# Altium schematic sheet Relay_Out_Interface.SchDoc
size A4
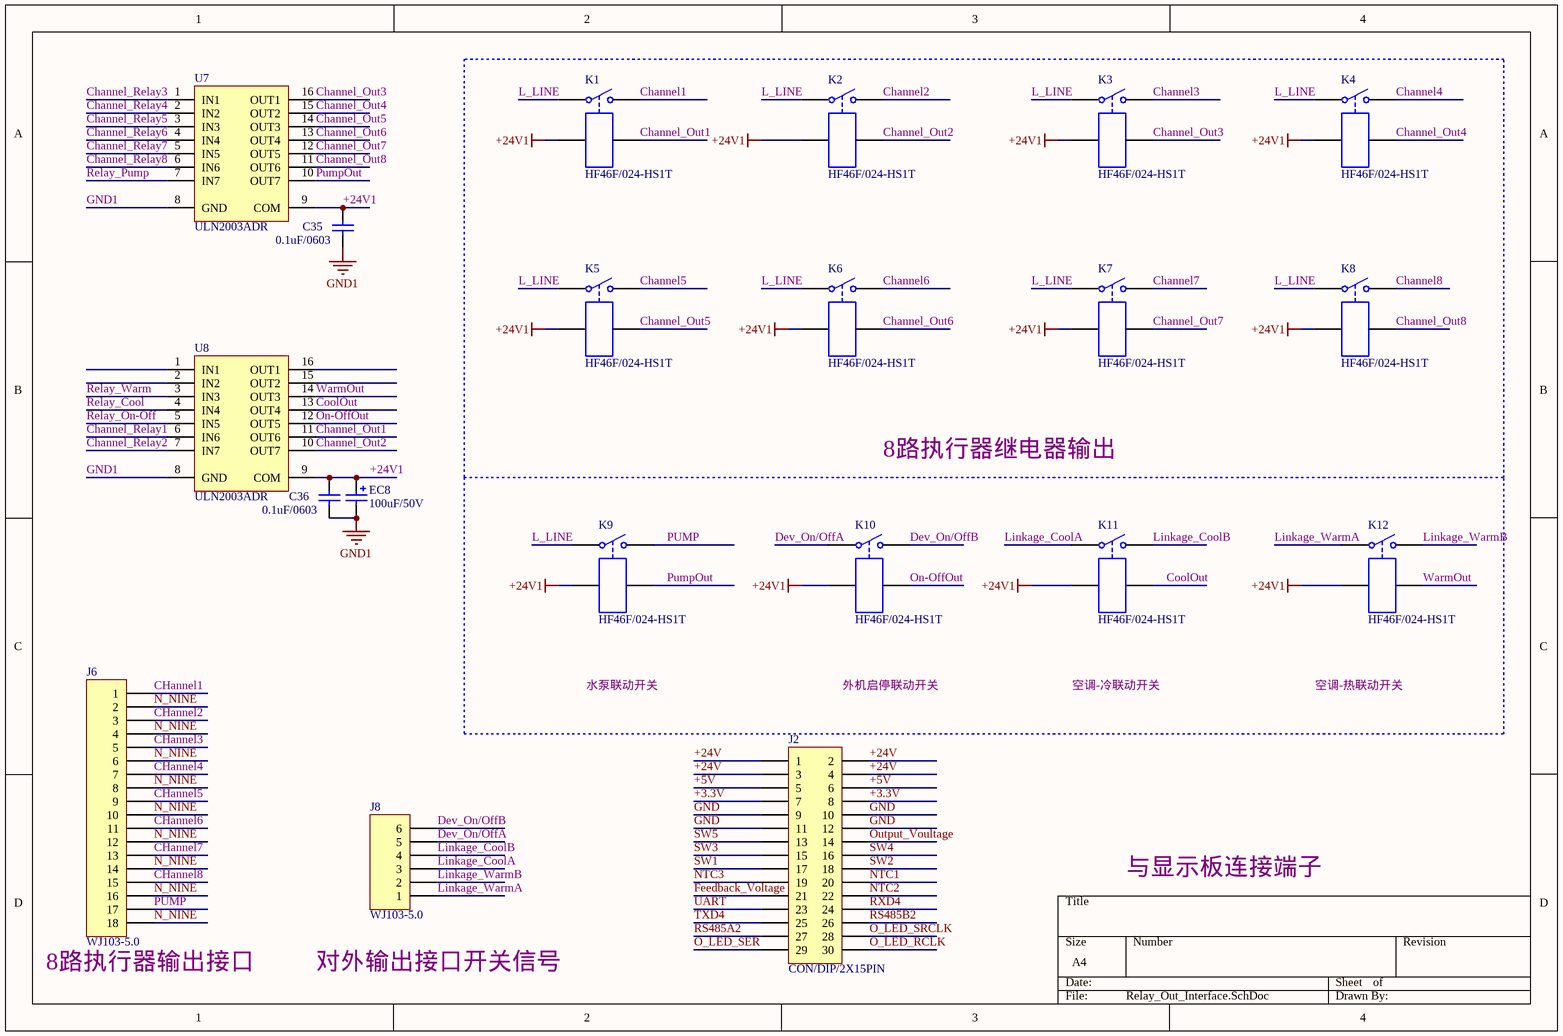
[diagram p0: Relay_Out_Interface.SchDoc]

## Parts
C35  0.1uF/0603  [CAP/SMT/0603C]
C36  0.1uF/0603  [CAP/SMT/0603C]
EC8  100uF/50V  [CAP/SMT/220UF/16V]
J2  CON/DIP/2X15PIN  [CON/DIP/2X15PIN/2.54MM]
J6  WJ103-5.0  [CON/DIP/1×18PIN/5.0MM/WJ103-18P]
J8  WJ103-5.0  [CON/DIP/1×6PIN/5.0MM/WJ103-6P]
K1  HF46F/024-HS1T  [RELAY/HF46F-012-HSIT]
K2  HF46F/024-HS1T  [RELAY/HF46F-012-HSIT]
K3  HF46F/024-HS1T  [RELAY/HF46F-012-HSIT]
K4  HF46F/024-HS1T  [RELAY/HF46F-012-HSIT]
K5  HF46F/024-HS1T  [RELAY/HF46F-012-HSIT]
K6  HF46F/024-HS1T  [RELAY/HF46F-012-HSIT]
K7  HF46F/024-HS1T  [RELAY/HF46F-012-HSIT]
K8  HF46F/024-HS1T  [RELAY/HF46F-012-HSIT]
K9  HF46F/024-HS1T  [RELAY/HF46F-012-HSIT]
K10  HF46F/024-HS1T  [RELAY/HF46F-012-HSIT]
K11  HF46F/024-HS1T  [RELAY/HF46F-012-HSIT]
K12  HF46F/024-HS1T  [RELAY/HF46F-012-HSIT]
U7  ULN2003ADR  [SOP-16]
U8  ULN2003ADR  [SOP-16]

## Nets
+24V1: C35.2 C36.2 EC8.1 K1.3 K2.3 K3.3 K4.3 K5.3 K6.3 K7.3 K8.3 K9.3 K10.3 K11.3 K12.3 U7.9(COM) U8.9(COM)
GND1: C35.1 C36.1 EC8.2 U7.8(GND) U8.8(GND)
+3.3V: J2.7 J2.8
+5V: J2.5 J2.6
+24V: J2.1 J2.2 J2.3 J2.4
Channel1: J6.1 K1.1
Channel2: J6.3 K2.1
Channel3: J6.5 K3.1
Channel4: J6.7 K4.1
Channel5: J6.9 K5.1
Channel6: J6.11 K6.1
Channel7: J6.13 K7.1
Channel8: J6.15 K8.1
Channel_Out1: K1.4 U8.11(OUT6)
Channel_Out2: K2.4 U8.10(OUT7)
Channel_Out3: K3.4 U7.16(OUT1)
Channel_Out4: K4.4 U7.15(OUT2)
Channel_Out5: K5.4 U7.14(OUT3)
Channel_Out6: K6.4 U7.13(OUT4)
Channel_Out7: K7.4 U7.12(OUT5)
Channel_Out8: K8.4 U7.11(OUT6)
Channel_Relay1: U8.6(IN6)
Channel_Relay2: U8.7(IN7)
Channel_Relay3: U7.1(IN1)
Channel_Relay4: U7.2(IN2)
Channel_Relay5: U7.3(IN3)
Channel_Relay6: U7.4(IN4)
Channel_Relay7: U7.5(IN5)
Channel_Relay8: U7.6(IN6)
CoolOut: K11.4 U8.13(OUT4)
Dev_On/OffA: J8.5 K10.2
Dev_On/OffB: J8.6 K10.1
Feedback_Voltage: J2.21
GND: J2.9 J2.10 J2.11 J2.12
L_LINE: K1.2 K2.2 K3.2 K4.2 K5.2 K6.2 K7.2 K8.2 K9.2
Linkage_CoolA: J8.3 K11.2
Linkage_CoolB: J8.4 K11.1
Linkage_WarmA: J8.1 K12.2
Linkage_WarmB: J8.2 K12.1
N_NINE: J6.2 J6.4 J6.6 J6.8 J6.10 J6.12 J6.14 J6.16 J6.18
NTC1: J2.20
NTC2: J2.22
NTC3: J2.19
O_LED_RCLK: J2.30
O_LED_SER: J2.29
O_LED_SRCLK: J2.28
On-OffOut: K10.4 U8.12(OUT5)
Output_Voultage: J2.14
PUMP: J6.17 K9.1
PumpOut: K9.4 U7.10(OUT7)
Relay_Cool: U8.4(IN4)
Relay_On-Off: U8.5(IN5)
Relay_Pump: U7.7(IN7)
Relay_Warm: U8.3(IN3)
RS485A2: J2.27
RS485B2: J2.26
RXD4: J2.24
SW1: J2.17
SW2: J2.18
SW3: J2.15
SW4: J2.16
SW5: J2.13
TXD4: J2.25
UART: J2.23
WarmOut: K12.4 U8.14(OUT3)

Not connected (* = marked no-connect by the designer): U8 1(IN1) 2(IN2) 15(OUT2) 16(OUT1)

## Notes on the sheet
- Labels drawn without touching a wire or pin: 8路执行器继电器输出, 8路执行器输出接口, 与显示板连接端子, 外机启停联动开关, 对外输出接口开关信号, 水泵联动开关, 空调-冷联动开关, 空调-热联动开关

## Library data of the parts
C35 C36 = CAP/CAP/SMT/0603C
EC8 = CAP/AEC/DIP/330uF/25V
J2 = CON/DIP/2X15PIN: Connector; LatestRevisionDate: 17-Jul-2002; LatestRevisionNote: Re-released for DXP Platform.; Publisher: Altium Limited
J6 = CON/DIP/1X18PIN/WJ103-5.0MM: Connector
J8 = CON/DIP/1X6PIN/WJ103-5.0MM: Connector
K1-K12 = RELAY/GENERAL/DIP/HF46F/012-HS1T
U7 U8 = IC/DRIVE/SMT/ULN2003ADR/SOIC-16: High-Voltage, High-Current Darlington Array; Published: 13-Oct-2000; LatestRevisionDate: 13-Apr-2006; LatestRevisionNote: IPC-7351 Footprint Added.; DatasheetVersion: 1998; PackageReference: L16; Publisher: Altium Limited; PackageDescription: 16-Pin Small Outline Integrated Circuit 1.27 mm Pitch; Code_JEDEC: MS-012-AC; Code_IPC: SOIC127P600-16; ComponentLink1Description: Manufacturer Link; ComponentLink1URL: http://www.allegromicro.com/